# Altium schematic sheet UWB-NODE.SchDoc
size A; SheetNumber: 1; SheetTotal: 3
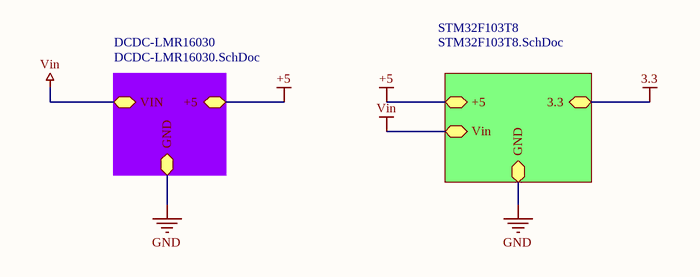
[diagram p0: UWB-NODE.SchDoc]

## Sub-sheets
DCDC-LMR16030 = DCDC-LMR16030.SchDoc: GND (bidir), VIN (bidir), +5 (bidir)
STM32F103T8 = STM32F103T8.SchDoc: GND (bidir), +5 (bidir), 3.3 (bidir), Vin (bidir)

## Nets
3.3: sheet STM32F103T8/3.3
+5: sheet DCDC-LMR16030/+5, sheet STM32F103T8/+5
GND: sheet DCDC-LMR16030/GND, sheet STM32F103T8/GND
Vin: sheet DCDC-LMR16030/VIN, sheet STM32F103T8/Vin